# EAGLE design 4way (EAGLE 4.16)
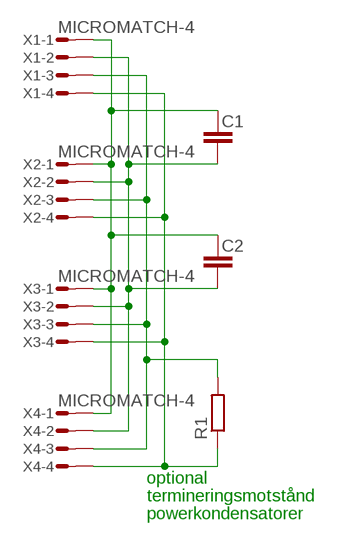
[diagram p0: schematic, sheet 1]

## Parts
C1  C-EU  [C0603]
C2  C-EU  [C0603]
R1  R-EUR0603  [R0603]
X1  MICROMATCH-4  [MICROMATCH-4]
X2  MICROMATCH-4  [MICROMATCH-4]
X3  MICROMATCH-4  [MICROMATCH-4]
X4  MICROMATCH-4  [MICROMATCH-4]

## Nets
CANH: R1.1 X1.4 X2.4 X3.4 X4.4
CANL: R1.2 X1.3 X2.3 X3.3 X4.3
GND: C1.1 C2.1 X1.1 X2.1 X3.1 X4.1
VCC_ARNE: C1.2 C2.2 X1.2 X2.2 X3.2 X4.2

## Notes on the sheet
- optional
- termineringsmotstånd
- powerkondensatorer

## Library data of the parts
C1 C2 = rcl:C-EU
R1 = rcl:R-EU
X1-X4 = con-amp-micromatch:MICROMATCH-4: MicroMaTch 4 7-215464-4 / 0-215464-4 Drawing Number C-215464 DDEController.pdf

## Board
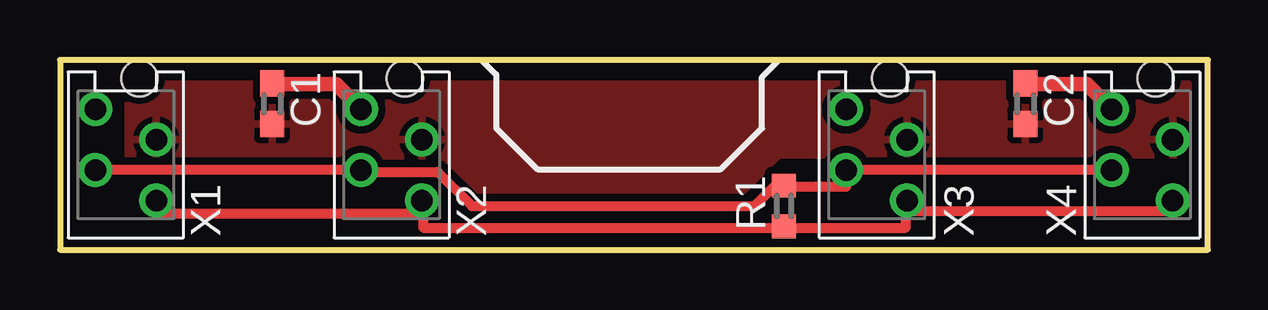
[diagram p1: board, top side]
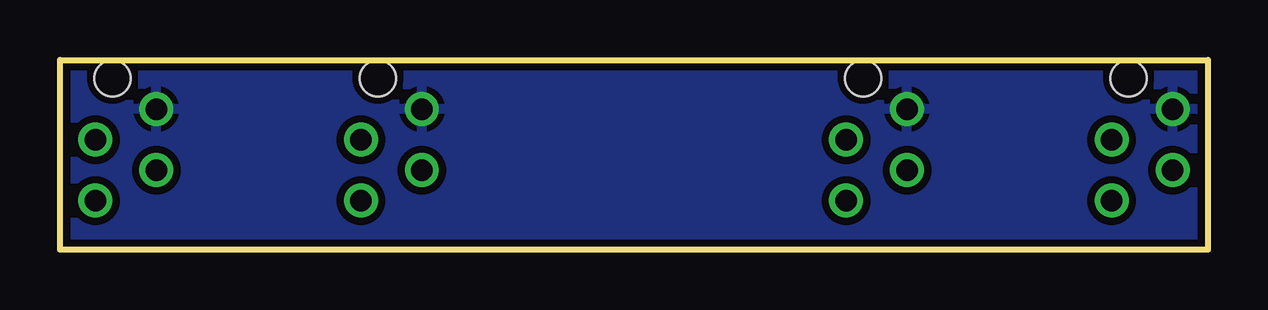
[diagram p2: board, bottom side, seen from below]

Size 47.85 x 7.92 mm. Coordinates in mm from the lower left corner, seen from the top.
Outline: 47.85,0 47.85,7.92 0,7.92 0,0 47.85,0
Copper layers (1*16): Top 0.035mm / dielectric 1.5mm / Bottom 0.035mm
Design rules "10mils": minimum track width 10mil, minimum drill 0.7mm, track to track 10mil, track to pad 10mil, pad to pad 10mil, via to via 10mil, smd to smd 10mil, copper to edge 10mil, drill to drill 10mil, minimum pad ring 10mil, minimum via ring 10mil, stop-mask expansion 0mil, vias tented up to drill 0mil, thermal gap 10mil

### Footprints (pad centres in the part's own frame; a part is rotated, then mirrored left to right if it is on the bottom)
C0603 = smd 1.1 x 1: 1 -0.85,0; 2 0.85,0
R0603 = smd 0.991 x 1.016: 1 -0.85,0; 2 0.85,0
MICROMATCH-4 = drill 0.9 round: 1 1.905,1.27; 2 0.635,-1.27; 3 -0.635,1.27; 4 -1.905,-1.27 | hole 1.5: 3.199,-0.562

### Placement (x,y rotation side)
C1  8.84,6.1 270 top
C2  40.23,6.1 270 top
R1  30.18,1.83 90 top
X1  2.74,3.96 90 top
X2  13.82,3.96 90 top
X3  34.04,3.96 90 top
X4  45.11,3.96 90 top

### Tracks (layer width: path | path; a pad name or v marks a point on that pad's centre or on a via)
CANH
  Top 0.406: 35.31,1.63 35.26,1.63 35.26,0.91 30.18,0.91 | 35.31,1.63 X3.4 | X4.4 46.38,1.63 35.31,1.63 | X1.4 4.01,1.52 15.14,1.52 15.14,1.73 | 15.14,1.73 15.14,2.03 15.09,2.03 X2.4 15.09,1.73 15.14,1.73 | 30.18,0.91 R1.1 | 30.18,0.91 15.14,0.91 15.14,1.73
CANL
  Top 0.406: 32.77,3.35 32.72,3.35 | 32.77,3.35 X3.3 32.77,2.64 30.18,2.64 R1.2 30.11,2.74 29.87,2.74 28.96,1.83 17.17,1.83 15.75,3.25 12.62,3.25 X2.3 12.55,3.35 | X4.3 43.84,3.35 32.77,3.35 | 12.55,3.35 12.7,3.35 | X1.3 1.47,3.35 12.55,3.35
GND
  Top 0.61: C2.1 40.27,6.91 42.8,6.91 X4.1 | C1.1 8.88,6.91 11.51,6.91 X2.1
  pour Bottom (isolate 0.305): 0.2,0.2 0.2,7.72 47.65,7.72 47.65,0.2
VCC_ARNE
  pour Top (isolate 0.305): 2.84,3.76 2.84,6.91 47.04,6.91 47.04,3.96 29.97,3.96 28.35,2.34 17.37,2.34 15.95,3.76